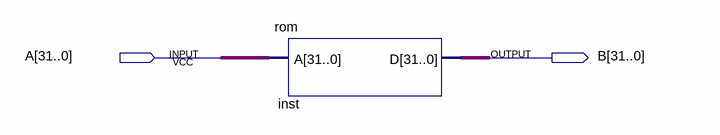
[diagram p0: schematic sheet]
// Quartus schematic rrom.bdf as structural Verilog: 1 symbols, 2 pins
module rrom (
  input  [31:0] A,
  output [31:0] B
);

  rom inst (.A(A), .D(B));
endmodule
